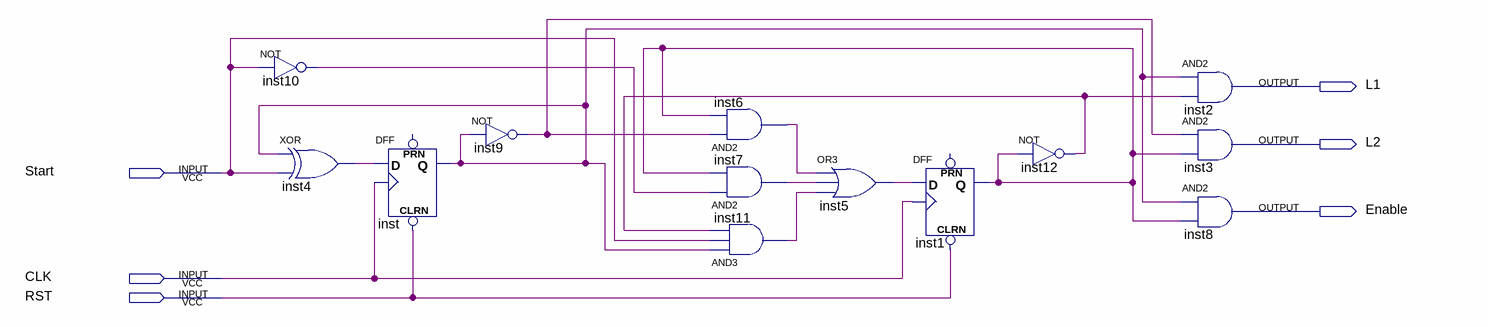
[diagram p0: schematic sheet]
// Quartus schematic FSM.bdf as structural Verilog: 13 symbols, 6 pins
module FSM (
  input  Start,
  input  CLK,
  input  RST,
  output L1,
  output L2,
  output Enable
);

  wire inst1_q, inst4_out, inst5_out, inst6_out, inst7_out, inst9_out, inst10_out, inst11_out, inst12_out,
       inst_q;

  not inst10 (inst10_out, Start);
  xor inst4 (inst4_out, inst_q, Start);
  DFF inst (.CLRN(RST), .CLK(CLK), .D(inst4_out), .Q(inst_q));  // open: PRN
  not inst9 (inst9_out, inst_q);
  and inst6 (inst6_out, inst9_out, inst1_q);
  and inst7 (inst7_out, inst10_out, inst1_q);
  and inst11 (inst11_out, inst_q, Start, inst12_out);
  or inst5 (inst5_out, inst6_out, inst7_out, inst11_out);
  DFF inst1 (.CLRN(RST), .CLK(CLK), .D(inst5_out), .Q(inst1_q));  // open: PRN
  not inst12 (inst12_out, inst1_q);
  and inst2 (L1, inst_q, inst12_out);
  and inst3 (L2, inst9_out, inst1_q);
  and inst8 (Enable, inst_q, inst1_q);
endmodule
